# EAGLE design LED_Case_V4 (EAGLE 7.3.0)

## Sheet 1 of 2
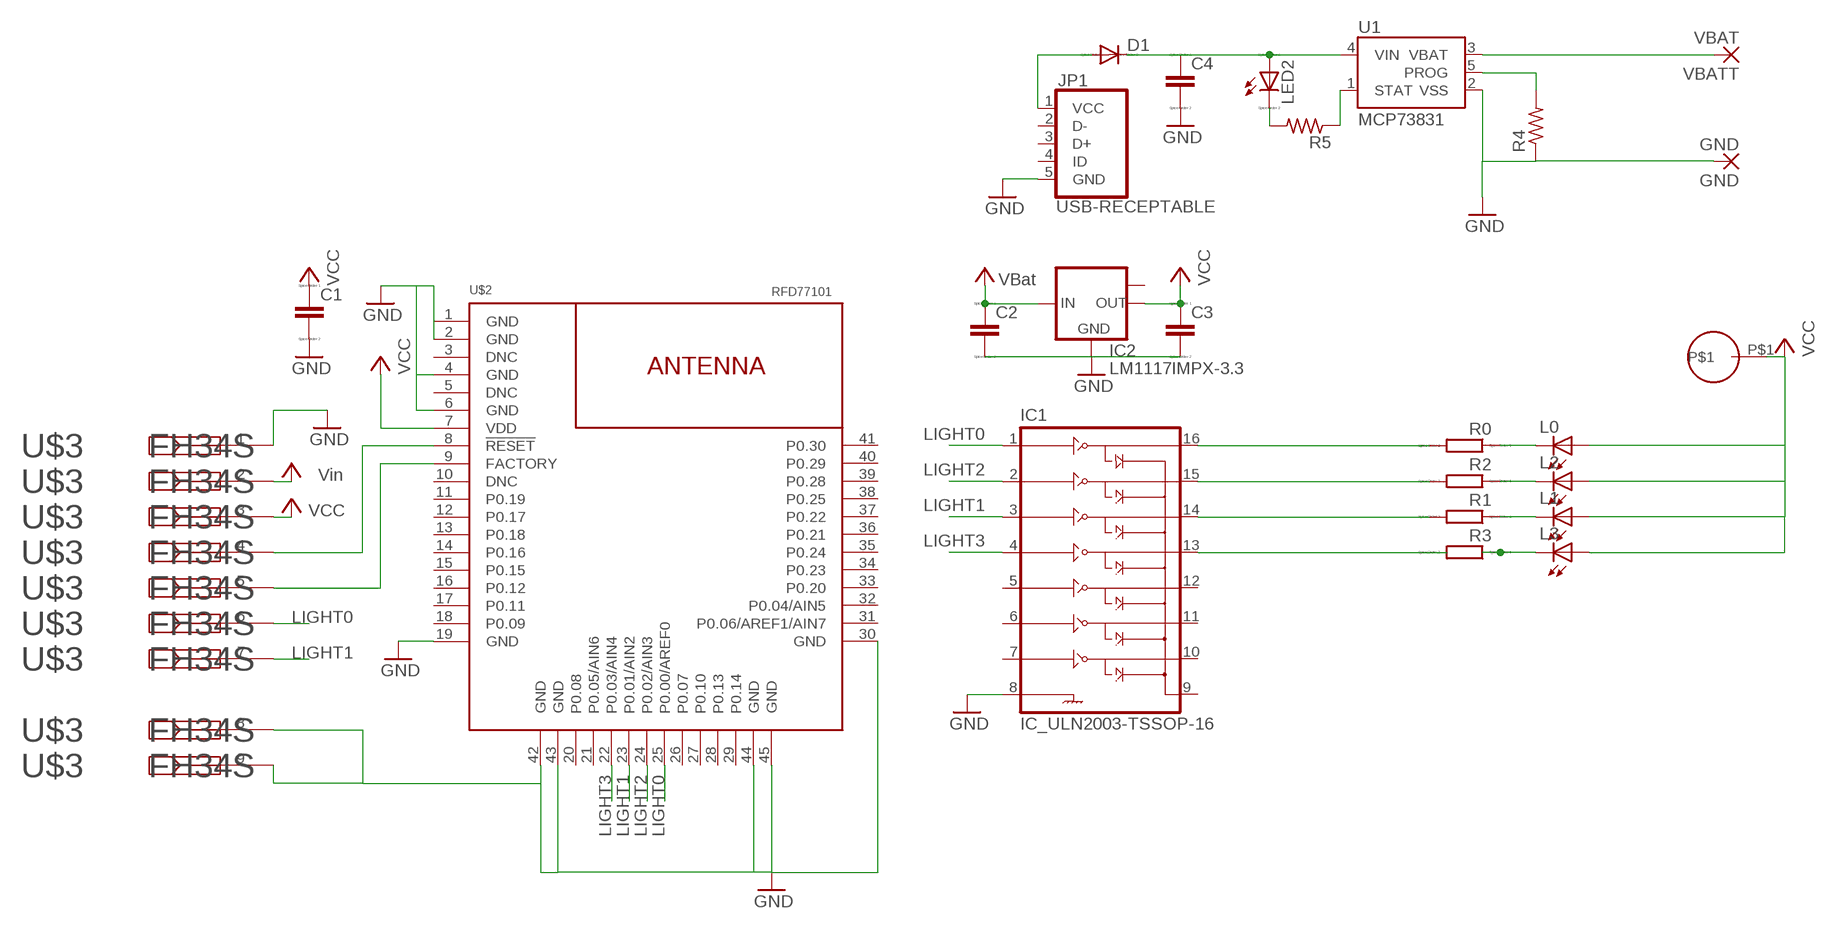
[diagram p0: schematic, sheet 1]

### Parts
C1  CC0603  [C0603]
C2  CC0603  [C0603]
C3  CC0603  [C0603]
C4  CC0603  [C0603]
D1  DIODE-DO214AC  [DO214AC]
GND  GND  SMD2  [SMD1,27-2,54]
IC1  IC_ULN2003-TSSOP-16  [TSSOP-16]
IC2  LM1117IMPX-3.3  [SOT223]
JP1  USB-RECEPTABLE  [FCI-10103594-0001LF]
L0  LEDCHIP-LED0805  [CHIP-LED0805]
L1  LEDCHIP-LED0805  [CHIP-LED0805]
L2  LEDCHIP-LED0805  [CHIP-LED0805]
L3  LEDP-LCC-2-SMT  [P-LCC-2-WIDE]
LED2  LED_ESML0603  [LED_SML0603]
R0  RR0603  [R0603]
R1  RR0603  [R0603]
R2  RR0603  [R0603]
R3  RR0603  [R0603]
R4  R-US_R0603  [R0603]
R5  R-US_R0603  [R0603]
U1  MCP73831  [SOT23-5]
U$1  RING_CONNECTOR  [RING]
U$2  RFD77101  [RFD77101]
U$3  FH34S  [CONN7_1X7_DR_FFC]
VBATT  VBAT  SMD2  [SMD1,27-2,54]

### Nets
GND: C1.2 C2.2 C3.2 C4.2 GND.1(P) IC1.8(GND) IC2.1(GND) JP1.5(GND) R4.1 U1.2(VSS) U$2.1(GND) U$2.2(GND) U$2.4(GND) U$2.6(GND) U$2.19(GND) U$2.30(GND) U$2.42(GND) U$2.43(GND) U$2.44(GND) U$2.45(GND) U$3.1 U$3.8 U$3.9
LIGHT0: IC1.1(1B) U$2.25(P0.00/AREF0) U$3.6
LIGHT1: IC1.3(3B) U$2.23(P0.01/AIN2) U$3.7
LIGHT2: IC1.2(2B) U$2.24(P0.02/AIN3)
LIGHT3: IC1.4(4B) U$2.22(P0.03/AIN4)
N$1: L0.C R0.1
N$2: L3.C R3.1
N$3: L2.C R2.1
N$4: U$2.9(FACTORY) U$3.5
N$5: L1.C R1.1
N$6: IC1.13(4C) R3.2
N$7: IC1.16(1C) R0.2
N$8: R4.2 U1.5(PROG)
N$9: IC1.15(2C) R2.2
N$10: D1.A JP1.1(VCC)
N$11: IC1.14(3C) R1.2
N$12: LED2.C R5.2
N$13: R5.1 U1.1(STAT)
RESET: U$2.8(!RESET!) U$3.4
VBAT: C2.1 IC2.3(IN) U1.3(VBAT) VBATT.1(P) ; supply symbol labelled VBat
VCC: C1.1 C3.1 IC2.2(OUT) L0.A L1.A L2.A L3.A U$1.P$1 U$2.7(VDD) U$3.3
VIN: C4.1 D1.C LED2.A U1.4(VIN) U$3.2 ; supply symbol labelled Vin
Unconnected: IC1.5(5B) IC1.6(6B) IC1.7(7B) IC1.9(COM) IC1.10(7C) IC1.11(6C) IC1.12(5C) IC2.TAB(OUT1) JP1.2(D-) JP1.3(D+) JP1.4(ID) U$2.3(DNC) U$2.5(DNC) U$2.10(DNC) U$2.11(P0.19) U$2.12(P0.17) U$2.13(P0.18) U$2.14(P0.16) U$2.15(P0.15) U$2.16(P0.12) U$2.17(P0.11) U$2.18(P0.09) U$2.20(P0.08) U$2.21(P0.05/AIN6) U$2.26(P0.07) U$2.27(P0.10) U$2.28(P0.13) U$2.29(P0.14) U$2.31(P0.06/AREF1/AIN7) U$2.32(P0.04/AIN5) U$2.33(P0.20) U$2.34(P0.23) U$2.35(P0.24) U$2.36(P0.21) U$2.37(P0.22) U$2.38(P0.25) U$2.39(P0.28) U$2.40(P0.29) U$2.41(P0.30)

## Sheet 2 of 2
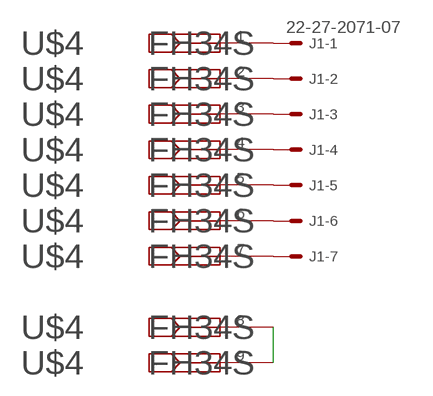
[diagram p1: schematic, sheet 2]

### Parts
J1  22-27-2071-07  [6410-07]
U$4  FH34S  [CONN7_1X7_DR_FFC]

### Nets
N$14: J1.1 U$4.1
N$15: J1.2 U$4.2
N$16: J1.3 U$4.3
N$17: J1.4 U$4.4
N$18: J1.5 U$4.5
N$19: J1.6 U$4.6
N$20: J1.7 U$4.7
PROG: U$4.8 U$4.9

## Library data of the parts
C1-C4 = eagle-ltspice:C: CAPACITOR, European symbol; SPICEMODEL: NONE; SPICEPREFIX: C
D1 = diode:DIODE-: DIODE
GND VBATT = wirepad:SMD2: SMD PAD
IC1 = dp_devices:IC_ULN2003: 7 Darlington Array Driver
IC2 = lm1117:LM1117IMPX-*
J1 = con-molex:22-?-07: CONNECTOR wire to board 2.54 mm (.1 inch) pitch header; OC_FARNELL: unknown; OC_NEWARK: unknown
JP1 = daspilker:USB-RECEPTABLE: USB Receptable
L0 L1 L2 = led:LED: LED OSRAM: - CHIPLED LG R971, LG N971, LY N971, LG Q971, LY Q971, LO R971, LY R971 LH N974, LH R974 LS Q976, LO Q976, LY Q976 LO Q996 - Hyper CHIPLED LW Q18S LB Q993, LB Q99A, LB R99A - SideLED LS A670, LO A670, LY A670, LG A670, LP A670 LB A673, LV A673, LT A673, LW A673 LH A674 LY A675 LS A676, LA A676, LO A676, LY A676, LW A676 LS A679, LY A679, LG A679 - Hyper Micro SIDELED® LS Y876, LA Y876, LO Y876, LY Y876 LT Y87S - SmartLED LW L88C, LW L88S LB L89C, LB L89S, LG L890 LS L89K, LO L89K, LY L89K LS L896, LA L896, LO L896, LY L896 - TOPLED LS T670, LO T670, LY T670, LG T670, LP T670 LSG T670, LSP T670, LSY T670, LOP T670, LYG T670 LG T671, LOG T671, LSG T671 LB T673, LV T673, LT T673, LW T673 LH T674 LS T676, LA T676, LO T676, LY T676, LB T676, LH T676, LSB T676, LW T676 LB T67C, LV T67C, LT T67C, LS T67K, LO T67K, LY T67K, LW E67C LS E67B, LA E67B, LO E67B, LY E67B, LB E67C, LV E67C, LT E67C LW T67C LS T679, LY T679, LG T679 LS T770, LO T770, LY T770, LG T770, LP T770 LB T773, LV T773, LT T773, LW T773 LH T774 LS E675, LA E675, LY E675, LS T675 LS T776, LA T776, LO T776, LY T776, LB T776 LHGB T686 LT T68C, LB T68C - Hyper Mini TOPLED® LB M676 - Mini TOPLED Santana® LG M470 LS M47K, LO M47K, LY M47K Source: http://www.osram.convergy.de LUXEON: - LUMILED® LXK2-PW12-R00, LXK2-PW12-S00, LXK2-PW14-U00, LXK2-PW14-V00 LXK2-PM12-R00, LXK2-PM12-S00, LXK2-PM14-U00 LXK2-PE12-Q00, LXK2-PE12-R00, LXK2-PE12-S00, LXK2-PE14-T00, LXK2-PE14-U00 LXK2-PB12-K00, LXK2-PB12-L00, LXK2-PB12-M00, LXK2-PB14-N00, LXK2-PB14-P00, LXK2-PB14-Q00 LXK2-PR12-L00, LXK2-PR12-M00, LXK2-PR14-Q00, LXK2-PR14-R00 LXK2-PD12-Q00, LXK2-PD12-R00, LXK2-PD12-S00 LXK2-PH12-R00, LXK2-PH12-S00 LXK2-PL12-P00, LXK2-PL12-Q00, LXK2-PL12-R00 Source: www.luxeon.com KINGBRIGHT: KA-3528ASYC Source: www.kingbright.com
L3 = led_mod:LED: LED OSRAM: - CHIPLED LG R971, LG N971, LY N971, LG Q971, LY Q971, LO R971, LY R971 LH N974, LH R974 LS Q976, LO Q976, LY Q976 LO Q996 - Hyper CHIPLED LW Q18S LB Q993, LB Q99A, LB R99A - SideLED LS A670, LO A670, LY A670, LG A670, LP A670 LB A673, LV A673, LT A673, LW A673 LH A674 LY A675 LS A676, LA A676, LO A676, LY A676, LW A676 LS A679, LY A679, LG A679 - Hyper Micro SIDELED® LS Y876, LA Y876, LO Y876, LY Y876 LT Y87S - SmartLED LW L88C, LW L88S LB L89C, LB L89S, LG L890 LS L89K, LO L89K, LY L89K LS L896, LA L896, LO L896, LY L896 - TOPLED LS T670, LO T670, LY T670, LG T670, LP T670 LSG T670, LSP T670, LSY T670, LOP T670, LYG T670 LG T671, LOG T671, LSG T671 LB T673, LV T673, LT T673, LW T673 LH T674 LS T676, LA T676, LO T676, LY T676, LB T676, LH T676, LSB T676, LW T676 LB T67C, LV T67C, LT T67C, LS T67K, LO T67K, LY T67K, LW E67C LS E67B, LA E67B, LO E67B, LY E67B, LB E67C, LV E67C, LT E67C LW T67C LS T679, LY T679, LG T679 LS T770, LO T770, LY T770, LG T770, LP T770 LB T773, LV T773, LT T773, LW T773 LH T774 LS E675, LA E675, LY E675, LS T675 LS T776, LA T776, LO T776, LY T776, LB T776 LHGB T686 LT T68C, LB T68C - Hyper Mini TOPLED® LB M676 - Mini TOPLED Santana® LG M470 LS M47K, LO M47K, LY M47K Source: http://www.osram.convergy.de LUXEON: - LUMILED® LXK2-PW12-R00, LXK2-PW12-S00, LXK2-PW14-U00, LXK2-PW14-V00 LXK2-PM12-R00, LXK2-PM12-S00, LXK2-PM14-U00 LXK2-PE12-Q00, LXK2-PE12-R00, LXK2-PE12-S00, LXK2-PE14-T00, LXK2-PE14-U00 LXK2-PB12-K00, LXK2-PB12-L00, LXK2-PB12-M00, LXK2-PB14-N00, LXK2-PB14-P00, LXK2-PB14-Q00 LXK2-PR12-L00, LXK2-PR12-M00, LXK2-PR14-Q00, LXK2-PR14-R00 LXK2-PD12-Q00, LXK2-PD12-R00, LXK2-PD12-S00 LXK2-PH12-R00, LXK2-PH12-S00 LXK2-PL12-P00, LXK2-PL12-Q00, LXK2-PL12-R00 Source: www.luxeon.com KINGBRIGHT: KA-3528ASYC Source: www.kingbright.com
LED2 = eagle-ltspice:LED_E: LED Source: http://www.osram.convergy.de Source: www.luxeon.com Source: www.kingbright.com; SPICEMODEL: NONE; SPICEPREFIX: D; SPICETYPE: diode
R0 R1-R3 = eagle-ltspice:R: RESISTOR, European symbol; SPICEMODEL: NONE; SPICEPREFIX: R
R4 R5 = rcl:R-US_: RESISTOR, American symbol
U1 = SparkFun-PowerIC:MCP73831: Miniature single cell, fully integrated Li-Ion, Li-polymer charge management controller http://ww1.microchip.com/downloads/en/DeviceDoc/21984a.pdf IC-09995; PROD_ID: IC-09995
U$1 = led_case:RING_CONNECTOR
U$2 = RFDigital:RFD77101: Simblee ™ BLE Module RFD77101 © 2015 RF Digital Corporation www.RFDigital.com www.Simblee.com PATENTS PENDING 04.01.2015
U$3 U$4 = FFC_7Pin:FH34S

## Board
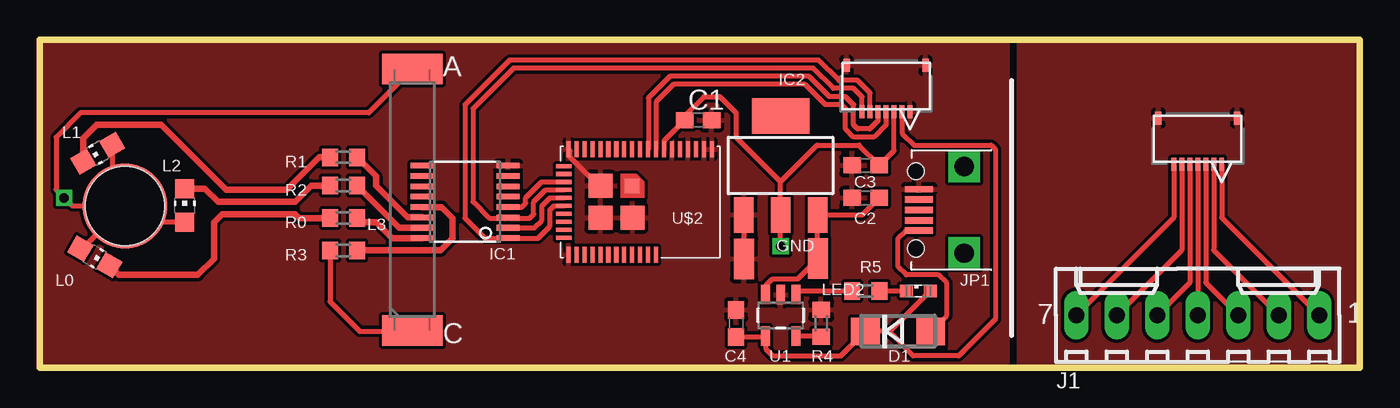
[diagram p2: board, top side]
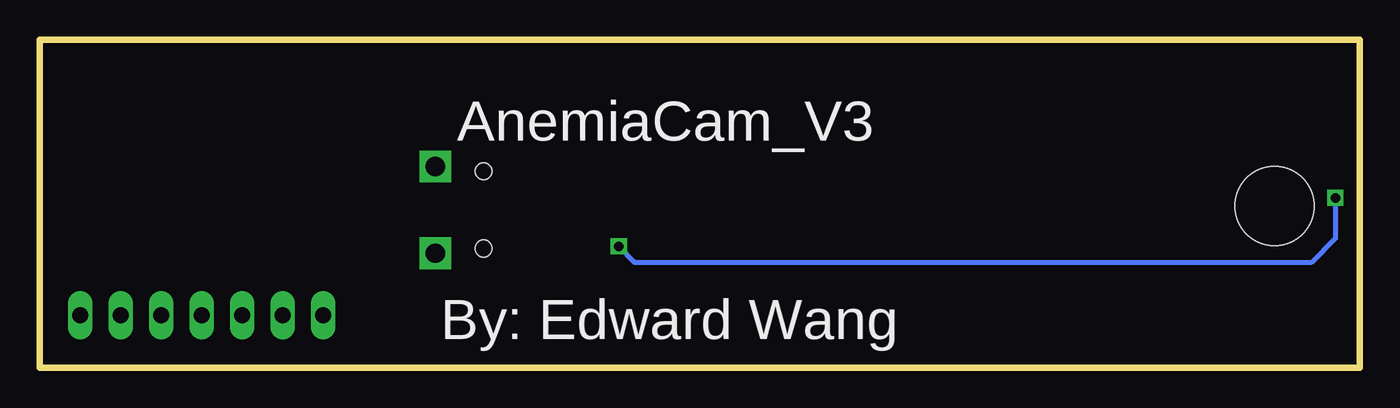
[diagram p3: board, bottom side, seen from below]

Size 82.8 x 20.57 mm. Coordinates in mm from the lower left corner, seen from the top.
Outline: 0,0 0,20.57 82.8,20.57 82.8,0 0,0
Copper layers (1*16): Top 0.035mm / dielectric 1.5mm / Bottom 0.035mm
Design rules "default *": minimum track width 10mil, minimum drill 24mil, track to track 8mil, track to pad 8mil, pad to pad 8mil, via to via 8mil, smd to smd 8mil, copper to edge 0mil, drill to drill 8mil, minimum pad ring 10mil, minimum via ring 8mil, stop-mask expansion 4mil, vias tented up to drill 0mil, thermal gap 10mil

### Footprints (pad centres in the part's own frame; a part is rotated, then mirrored left to right if it is on the bottom)
C0603 = smd 1.1 x 1: 1 -0.85,0; 2 0.85,0
DO214AC = smd 1.8 x 1.7: A 2.05,0; C -2.05,0
SMD1,27-2,54 = smd 1.27 x 2.54: 1 0,0
TSSOP-16 = smd 0.35 x 1.43: 1 -2.275,-2.7; 2 -1.625,-2.7; 3 -0.975,-2.7; 4 -0.325,-2.7; 5 0.325,-2.7; 6 0.975,-2.7; 7 1.625,-2.7; 8 2.275,-2.7; 9 2.275,2.7; 10 1.625,2.7; 11 0.975,2.7; 12 0.325,2.7; 13 -0.325,2.7; 14 -0.975,2.7; 15 -1.625,2.7; 16 -2.275,2.7
SOT223 = smd 1.219 x 2.235: 1 -2.311,-3.099; 2 0,-3.099; 3 2.311,-3.099 | smd 3.6 x 2.2: TAB 0,3.099
6410-07 = drill 1.016 long: 1 7.62,0; 2 5.08,0; 3 2.54,0; 4 0,0; 5 -2.54,0; 6 -5.08,0; 7 -7.62,0
FCI-10103594-0001LF = smd 0.4 x 1.75: 1 -1.3,4.525; 2 -0.65,4.525; 3 0,4.525; 4 0.65,4.525; 5 1.3,4.525 | drill 1.2 pad 2 square: P$3 -2.725,1.7; P$4 2.725,1.7 | hole 1.05: -2.425,4.73; 2.425,4.73
CHIP-LED0805 = smd 1.2 x 1.2: A 0,-1.05; C 0,1.05
P-LCC-2-WIDE = smd 3.81 x 1.93: A 0,7.564; C 0,-8.834
LED_SML0603 = smd 0.8 x 0.8: A 0.75,0; C -0.75,0
R0603 = smd 1 x 1.1: 1 -0.85,0; 2 0.85,0
SOT23-5 = smd 0.55 x 1.2: 1 -0.95,-1.3; 2 0,-1.3; 3 0.95,-1.3; 4 0.95,1.3; 5 -0.95,1.3
RING = smd 5.334 x 5.334: P$1 0,0 | hole 4.953: 0,0
RFD77101 = smd 1 x 0.254: 1 0,0; 2 0,-0.5; 3 0,-1; 4 0,-1.5; 5 0,-2; 6 0,-2.5; 7 0,-3; 8 0,-3.5; 9 0,-4; 10 0,-4.5; 11 0,-5; 12 0,-5.5; 13 0,-6; 14 0,-6.5; 15 0,-7; 16 0,-7.5; 17 0,-8; 18 0,-8.5; 19 0,-9; 30 6.61,-9; 31 6.61,-8.5; 32 6.61,-8; 33 6.61,-7.5; 34 6.61,-7; 35 6.61,-6.5; 36 6.61,-6; 37 6.61,-5.5; 38 6.61,-5; 39 6.61,-4.5; 40 6.61,-4; 41 6.61,-3.5 | smd 0.254 x 1: 20 1.055,-9.29; 21 1.555,-9.29; 22 2.055,-9.29; 23 2.555,-9.29; 24 3.055,-9.29; 25 3.555,-9.29; 26 4.055,-9.29; 27 4.555,-9.29; 28 5.055,-9.29; 29 5.555,-9.29 | smd 0.9 x 0.9: 42 2.3,-4.99 | smd 1.5 x 1.5: 43 2.3,-6.99; 44 4.3,-6.99; 45 4.3,-4.99
CONN7_1X7_DR_FFC = smd 0.305 x 0.813: 1 1.5,1.6; 2 1,1.6; 3 0.5,1.6; 4 0,1.6; 5 -0.5,1.6; 6 -1,1.6; 7 -1.5,1.6 | smd 0.406 x 0.813: 8 -2.477,4.496; 9 2.477,4.496

### Placement (x,y rotation side)
C1  41.3,15.54 0 top
C2  51.82,10.67 180 top
C3  51.82,12.7 180 top
C4  43.69,2.79 90 top
D1  53.85,2.29 0 top
GND  44.17,6.83 0 top
IC1  26.67,10.41 90 top
IC2  46.48,12.7 0 top
J1  72.64,3.3 0 top
JP1  59.69,9.91 90 top
L0  3.45,6.96 240 top
L1  3.63,13.46 120 top
L2  9.09,10.19 0 top
L3  23.37,11.18 0 top
LED2  55.12,4.83 0 top
R0  19.05,9.4 0 top
R1  19.05,13.21 0 top
R2  19.05,11.43 0 top
R3  19.05,7.37 0 top
R4  49.02,2.79 270 top
R5  51.82,4.83 0 top
U1  46.48,3.3 180 top
U$1  5.33,10.16 0 top
U$2  42.16,13.72 270 top
U$3  53.09,14.48 0 top
U$4  72.64,11.18 0 top
VBATT  48.82,6.86 0 top

### Tracks (layer width: path | path; a pad name or v marks a point on that pad's centre or on a via)
GND
  Top 0.305: U$2.43 35.07,11.42 33.27,13.21 33.27,13.61 U$2.19 | GND.1 44.2,9.58 IC2.1
  pour Top: 0,0 60.71,0 60.71,20.57 0,20.57
LIGHT0
  Top 0.305: U$2.25 32.26,10.16 32,9.91 32,8.89 31.24,8.13 29.38,8.13 IC1.1 27.93,8.14 26.67,9.4 26.67,16.51 29.46,19.3 48.86,19.3 50.13,18.03 51.31,18.03 52.09,17.26 U$3.6
LIGHT1
  Top 0.305: U$2.23 31.73,11.16 30.99,10.41 30.99,9.65 30.73,9.4 29.41,9.4 IC1.3 29.33,9.4 28.19,9.4 27.18,10.41 27.18,16.26 29.72,18.8 48.51,18.8 49.78,17.53 51.05,17.53 51.59,16.99 U$3.7
LIGHT2
  Top 0.305: IC1.2 31.01,8.79 31.5,9.27 31.5,10.16 32,10.66 U$2.24
LIGHT3
  Top 0.305: IC1.4 30.23,10.08 30.48,10.34 30.48,10.67 31.47,11.66 U$2.22
N$1
  Top 0.406: L0.C 4.96,5.84 9.91,5.84 10.92,6.86 10.92,9.14 11.43,9.65 16,9.65 16.26,9.4 R0.1
N$2
  Top 0.305: R3.1 18.2,4.15 20.07,2.29 23.31,2.29 L3.C
N$3
  Top 0.406: L2.C 10.36,11.24 11.18,10.41 16,10.41 17.02,11.43 R2.1
N$4
  Top 0.305: U$3.5 52.59,15.5 52.07,14.99 51.31,14.99 51.05,15.24 51.05,16.51 50.55,17.02 49.53,17.02 48.26,18.29 39.52,18.29 38.18,16.94 38.18,13.73 U$2.9
N$5
  Top 0.406: L1.C 2.72,14.41 3.56,15.24 7.62,15.24 11.68,11.18 15.49,11.18 17.53,13.21 R1.1
N$6
  Top 0.406: R3.2 25.15,7.37 25.91,8.13 25.91,9.4 25.22,10.09 IC1.13
N$7
  Top 0.406: R0.2 20.15,9.14 21.08,9.14 22.09,8.14 IC1.16
N$8
  Top 0.305: U1.5 48.96,2 R4.2
N$9
  Top 0.406: R2.2 22.54,8.79 IC1.15
N$10
  Top 0.305: D1.A 56.9,3.28 56.9,5.33 56.39,5.84 54.36,5.84 53.85,6.35 53.85,8.13 54.33,8.61 JP1.1
N$11
  Top 0.406: R1.2 21.08,12.03 21.08,11.43 23.07,9.44 IC1.14
N$12
  Top 0.305: R5.2 LED2.C
N$13
  Top 0.305: U1.1 47.53,4.6 47.75,4.83 R5.1
N$14
  Top 0.305: U$4.1 74.14,9.42 J1.1
N$15
  Top 0.305: U$4.2 73.64,7.38 J1.2
N$16
  Top 0.305: U$4.3 73.14,5.34 J1.3
N$17
  Top 0.305: U$4.4 J1.4
N$18
  Top 0.305: U$4.5 72.14,5.34 J1.5
N$19
  Top 0.305: U$4.6 71.64,7.38 J1.6
N$20
  Top 0.305: U$4.7 71.14,9.42 J1.7
PROG
  pour Top: 61.47,20.32 82.55,20.32 82.8,0.25 61.47,0.25
RESET
  Top 0.305: U$3.4 53.09,15.24 52.32,14.48 51.05,14.48 50.55,14.99 50.55,16.26 50.29,16.51 49.28,16.51 48.01,17.78 39.75,17.78 38.66,16.69 U$2.8
VBAT
  Top 0.305: C2.1 51.6,9.6 IC2.3 48.77,9.58 48.77,6.91 VBATT.1 47.55,5.59 45.97,5.59 45.57,5.18 45.57,4.64 U1.3
VCC  (via drill 0.6)
  Top 0.305: U$2.7 39.18,13.73 39.18,14.28 C1.1 40.45,15.81 41.66,17.02 42.67,17.02 43.69,16 43.69,14.48 46.48,11.68 | 46.48,11.68 IC2.2 v46.48,7.62 | 46.48,11.68 48.77,13.97 51.4,13.97 C3.1 53.59,13.62 U$3.3 | U$1.P$1 2.03,10.16 v1.52,10.67 1.02,11.18 1.02,14.48 2.54,16 20.63,16 L3.A | L1.A 4.54,10.95 U$1.P$1 | L2.A 6.36,9.13 U$1.P$1 | L0.A 2.66,7.48 U$1.P$1
  Bottom 0.305: v1.52,10.67 1.52,8.13 3.05,6.6 45.47,6.6 v46.48,7.62
VIN
  Top 0.305: U$3.2 54.1,16.06 54.1,14.73 54.86,13.97 59.69,13.97 59.94,13.72 59.94,3.05 57.66,0.76 54.79,0.76 53.33,2.22 53.33,2.29 | C4.1 45.47,1.94 U1.4 45.53,1.2 45.97,0.76 50.27,0.76 D1.C 53.33,2.29 | LED2.A 53.33,2.29

### Text on the board
bNames: AnemiaCam_V3 | By: Edward Wang